# Altium schematic sheet cover_page.SchDoc
size A4; Email: eliofagundez07@gmail.com; DrawnBy: Elio F.; Engineer: Elio F.; Revision: A; SheetNumber: 1; SheetTotal: 11; Sheet Title: Cover Page
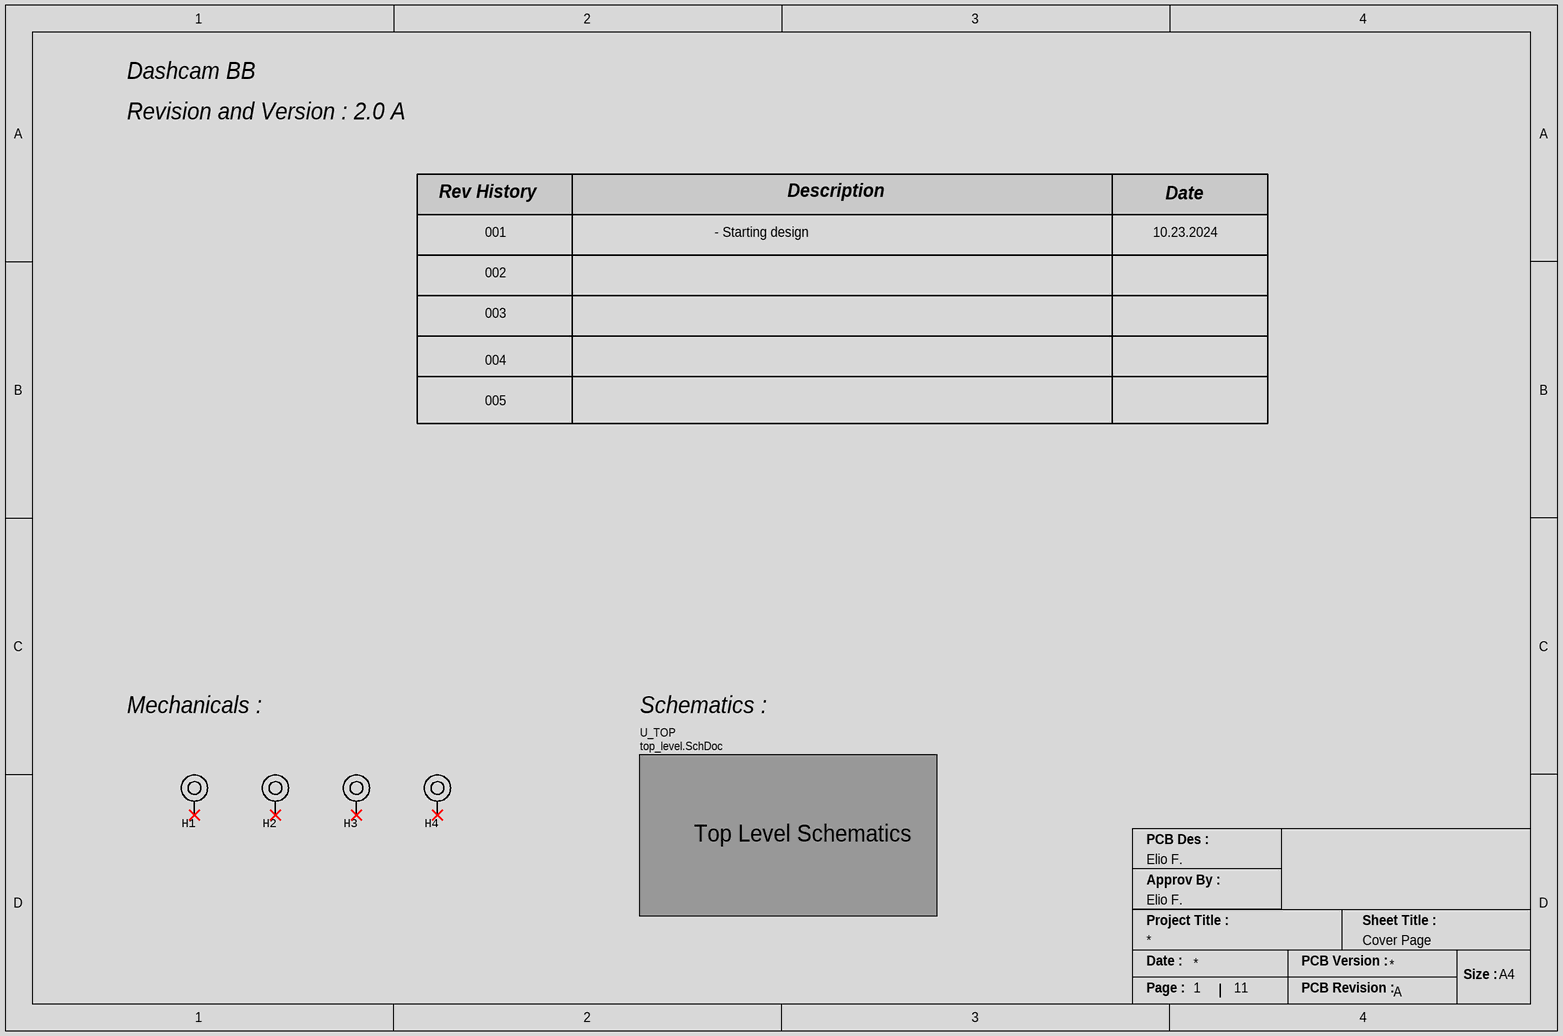
[diagram p0: cover_page.SchDoc]

## Parts
H1  Mounting Hole  [PTH_3.2X5]  (value not drawn)  (no BOM)
H2  Mounting Hole  [PTH_3.2X5]  (value not drawn)  (no BOM)
H3  Mounting Hole  [PTH_3.2X5]  (value not drawn)  (no BOM)
H4  Mounting Hole  [PTH_3.2X5]  (value not drawn)  (no BOM)

## Sub-sheets
U_TOP = top_level.SchDoc: no entries

## Nets

Not connected (* = marked no-connect by the designer): H1 1*; H2 1*; H3 1*; H4 1*

## Notes on the sheet
- Dashcam BB
- Revision and Version : 2.0 A
- Rev History
- 001
- - Starting design
- Description
- 10.23.2024
- Date
- 002
- 003
- 004
- 005
- Mechanicals :
- Schematics :
- Top Level Schematics
- PCB Des :
- Approv By :
- Project Title :
- Sheet Title :
- Date :
- PCB Version :
- Size :
- A4
- Page :
- PCB Revision :

## Library data of the parts
H1-H4 = MECHANICALS_MOUNT_PTH: Mounting Hole, Plated